# EAGLE schematic keypad_socket_a (EAGLE 6.2)
REV: A; TITLE: Thermostat Keypad Socket
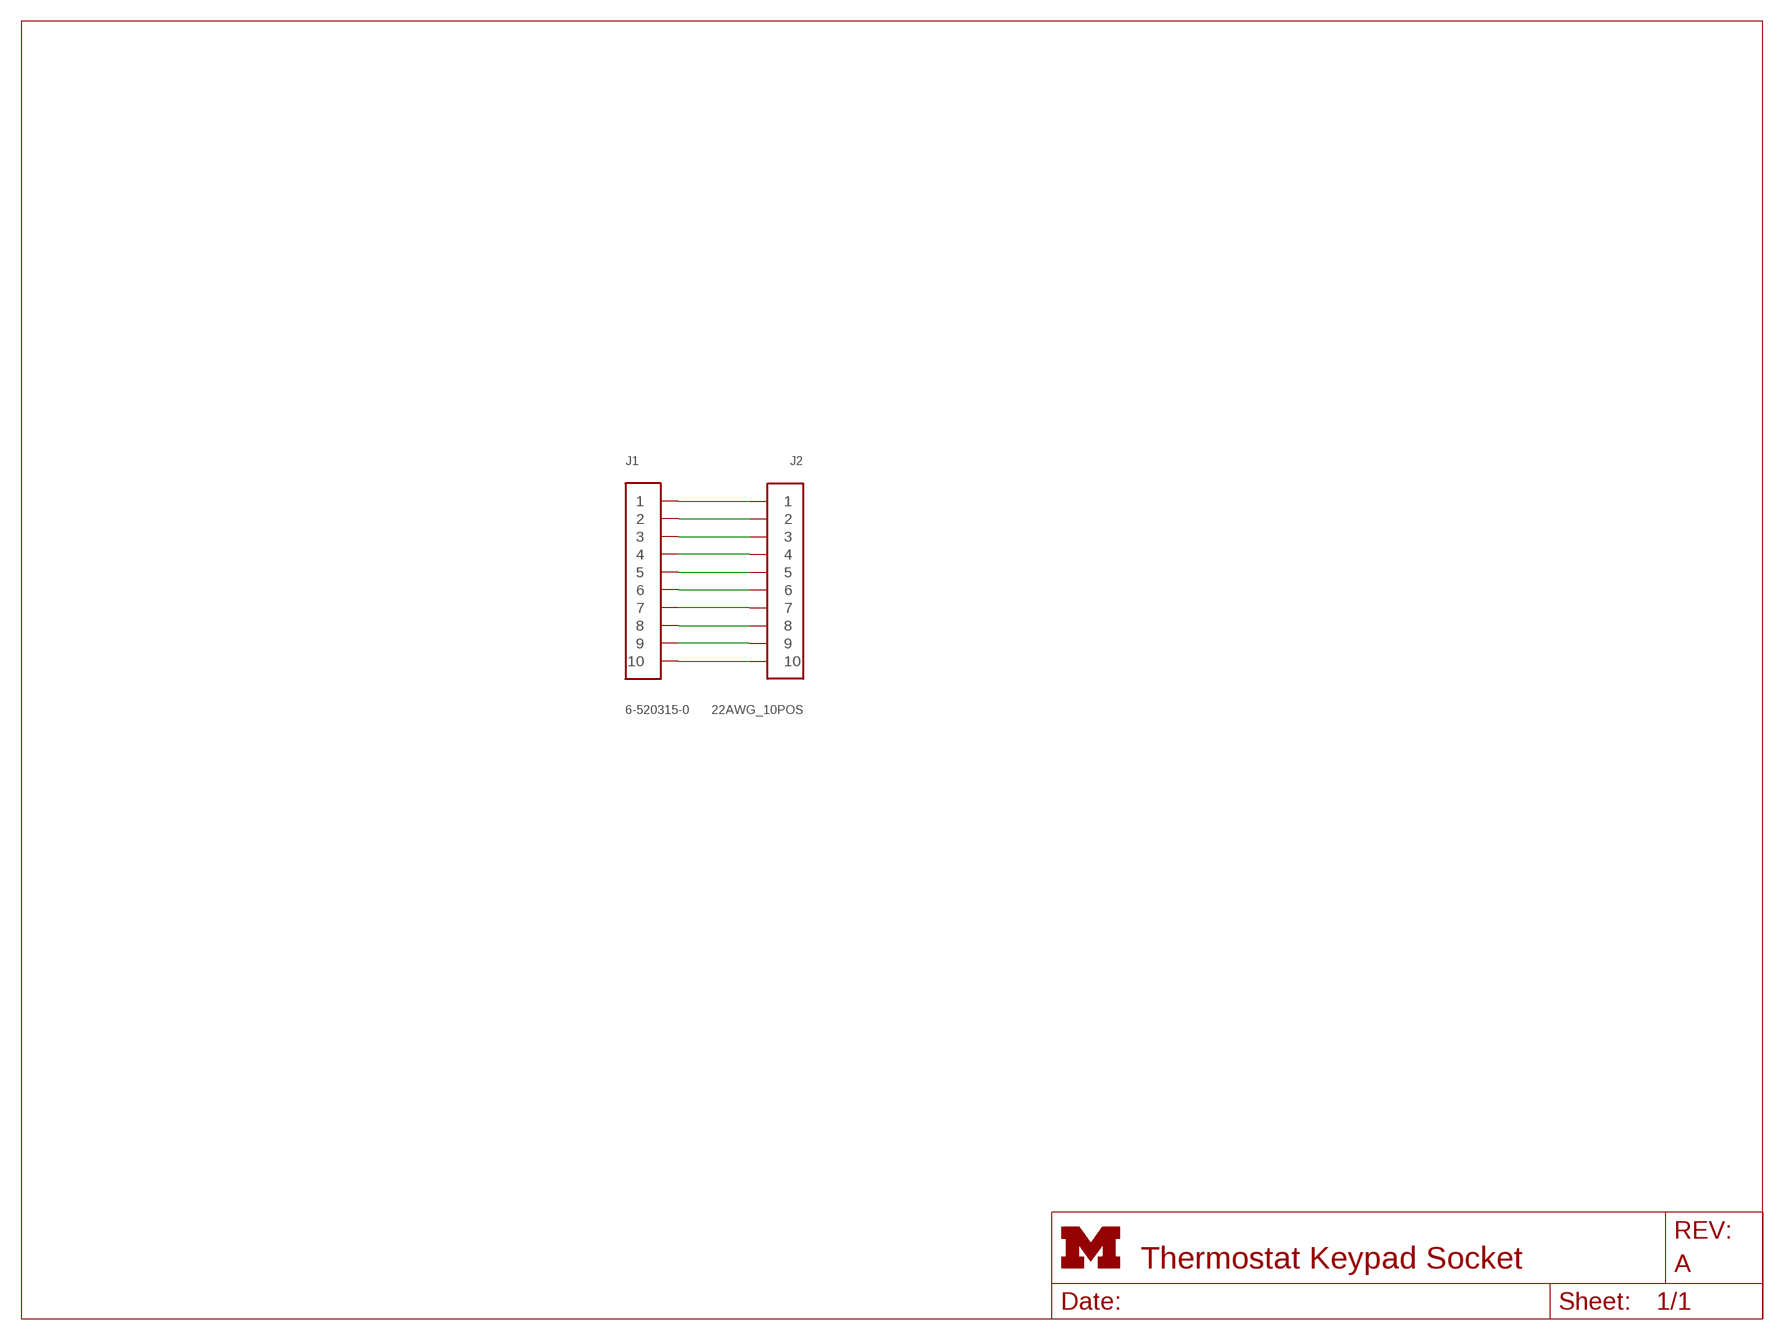
[diagram p0: schematic, sheet 1]

## Parts
J1  6-520315-0  [6-520315-0]
J2  22AWG_10POS  [22AWG_10POS]

## Nets
N$2: J1.1 J2.1
N$3: J1.10 J2.10
N$4: J1.2 J2.2
N$5: J1.3 J2.3
N$6: J1.4 J2.4
N$7: J1.5 J2.5
N$8: J1.6 J2.6
N$9: J1.7 J2.7
N$10: J1.8 J2.8
N$11: J1.9 J2.9

## Library data of the parts
J1 = nest_interface:6-520315-0: FFC thru-hole 10 pos 0.100in header.; DIGIKEY: 6-520315-0-ND
J2 = nest_interface:22AWG_10POS